# EAGLE schematic Test Stand Elec. (EAGLE 9.6.2)
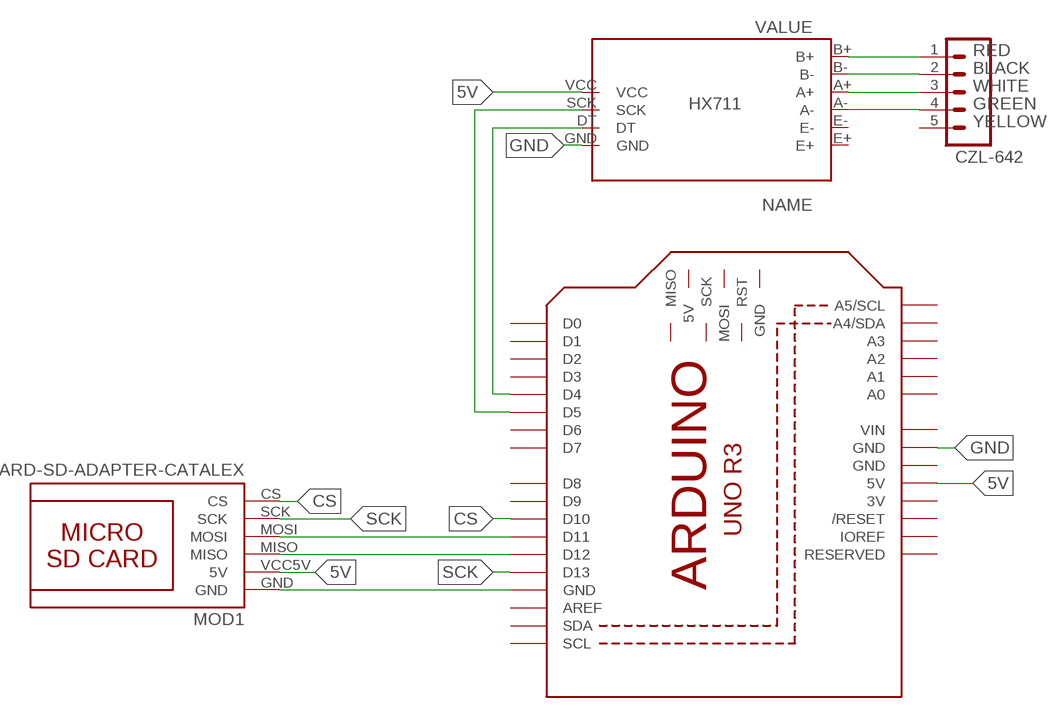
[diagram p0: schematic, sheet 1]

## Parts
JP4  M05PTH  [1X05]
M1  ARDUINO_R3_ICSP_NODIM  [ARDUINOR3_ICSP_NODIM]
MOD1  CARD-SD-ADAPTER-CATALEX  [CARD-SD-ADAPTER-CATALEX]
U$1  HX711A  [HX711]

## Nets
5V: M1.5V MOD1.VCC5V(5V) U$1.VCC
CS: M1.D10 MOD1.CS
GND: M1.GND@3(GND) U$1.GND
N$1: JP4.1 U$1.B+
N$2: M1.D4 U$1.DT
N$3: M1.D5 U$1.SCK
N$4: JP4.2 U$1.B-
N$5: M1.GND MOD1.GND
N$6: JP4.3 U$1.A+
N$7: M1.D12 MOD1.MISO
N$8: M1.D11 MOD1.MOSI
N$9: JP4.4 U$1.A-
SCK: M1.D13 MOD1.SCK
Unconnected: JP4.5 M1.5V_ICSP(5V) M1.A0 M1.A1 M1.A2 M1.A3 M1.A4(A4/SDA) M1.A5(A5/SCL) M1.AREF M1.D0 M1.D1 M1.D2 M1.D3 M1.D6 M1.D7 M1.D8 M1.D9 M1.GND@2(GND) M1.IOREF M1.MISO M1.MOSI M1.RESERVED M1.RESET(/RESET) M1.RESET_ICSP(RST) M1.SCK M1.SCL M1.SDA U$1.E+ U$1.E-

## Notes on the sheet
- RED
- BLACK
- WHITE
- HX711 | GREEN
- YELLOW
- CZL-642

## Power pins joined to a net without a drawn wire
3V: M1.3V
GND: M1.GND@1(GND)
VIN: M1.VIN

## Library data of the parts
JP4 = SparkFun-Connectors:M05: Header 5 Standard 5-pin 0.1" header. Use with straight break away headers (SKU : PRT-00116), right angle break away headers (PRT-00553), swiss pins (PRT-00743), machine pins (PRT-00117), and female headers (PRT-00115). Molex polarized connector foot print use with SKU : PRT-08230 with associated crimp pins and housings.
M1 = adafruit:ARDUINO_R3_ICSP
MOD1 = SD-Card-Module_CATALEX:CARD-SD-ADAPTER-CATALEX: Micro SD Card Adapter Module with onboard 3.3V regulator
U$1 = HX711:HX711